# Altium schematic sheet sup&con.SchDoc
size 420 x 297 mm; PageSetup: Record=PageOptions|CenterHorizontal=True|CenterVertical=True|PrintScale=0.94|XCorrection=1.00|YCorrection=1.00|PrintKind=1|BorderSize=5000000|LeftOffset=0|BottomOffset=0|Orientation=1|PaperLength=1000|PaperWidth=1000|Scale=100|PaperSource=7|PrintQuality=-4|MediaType=1|DitherType=10|PaperKind=A4|PrintScaleMode=1; DecimalNumber: Децимальный номер; HeadOfSector: Нач. сектора; MainDevice: Перв.примен.; Name: Наименование
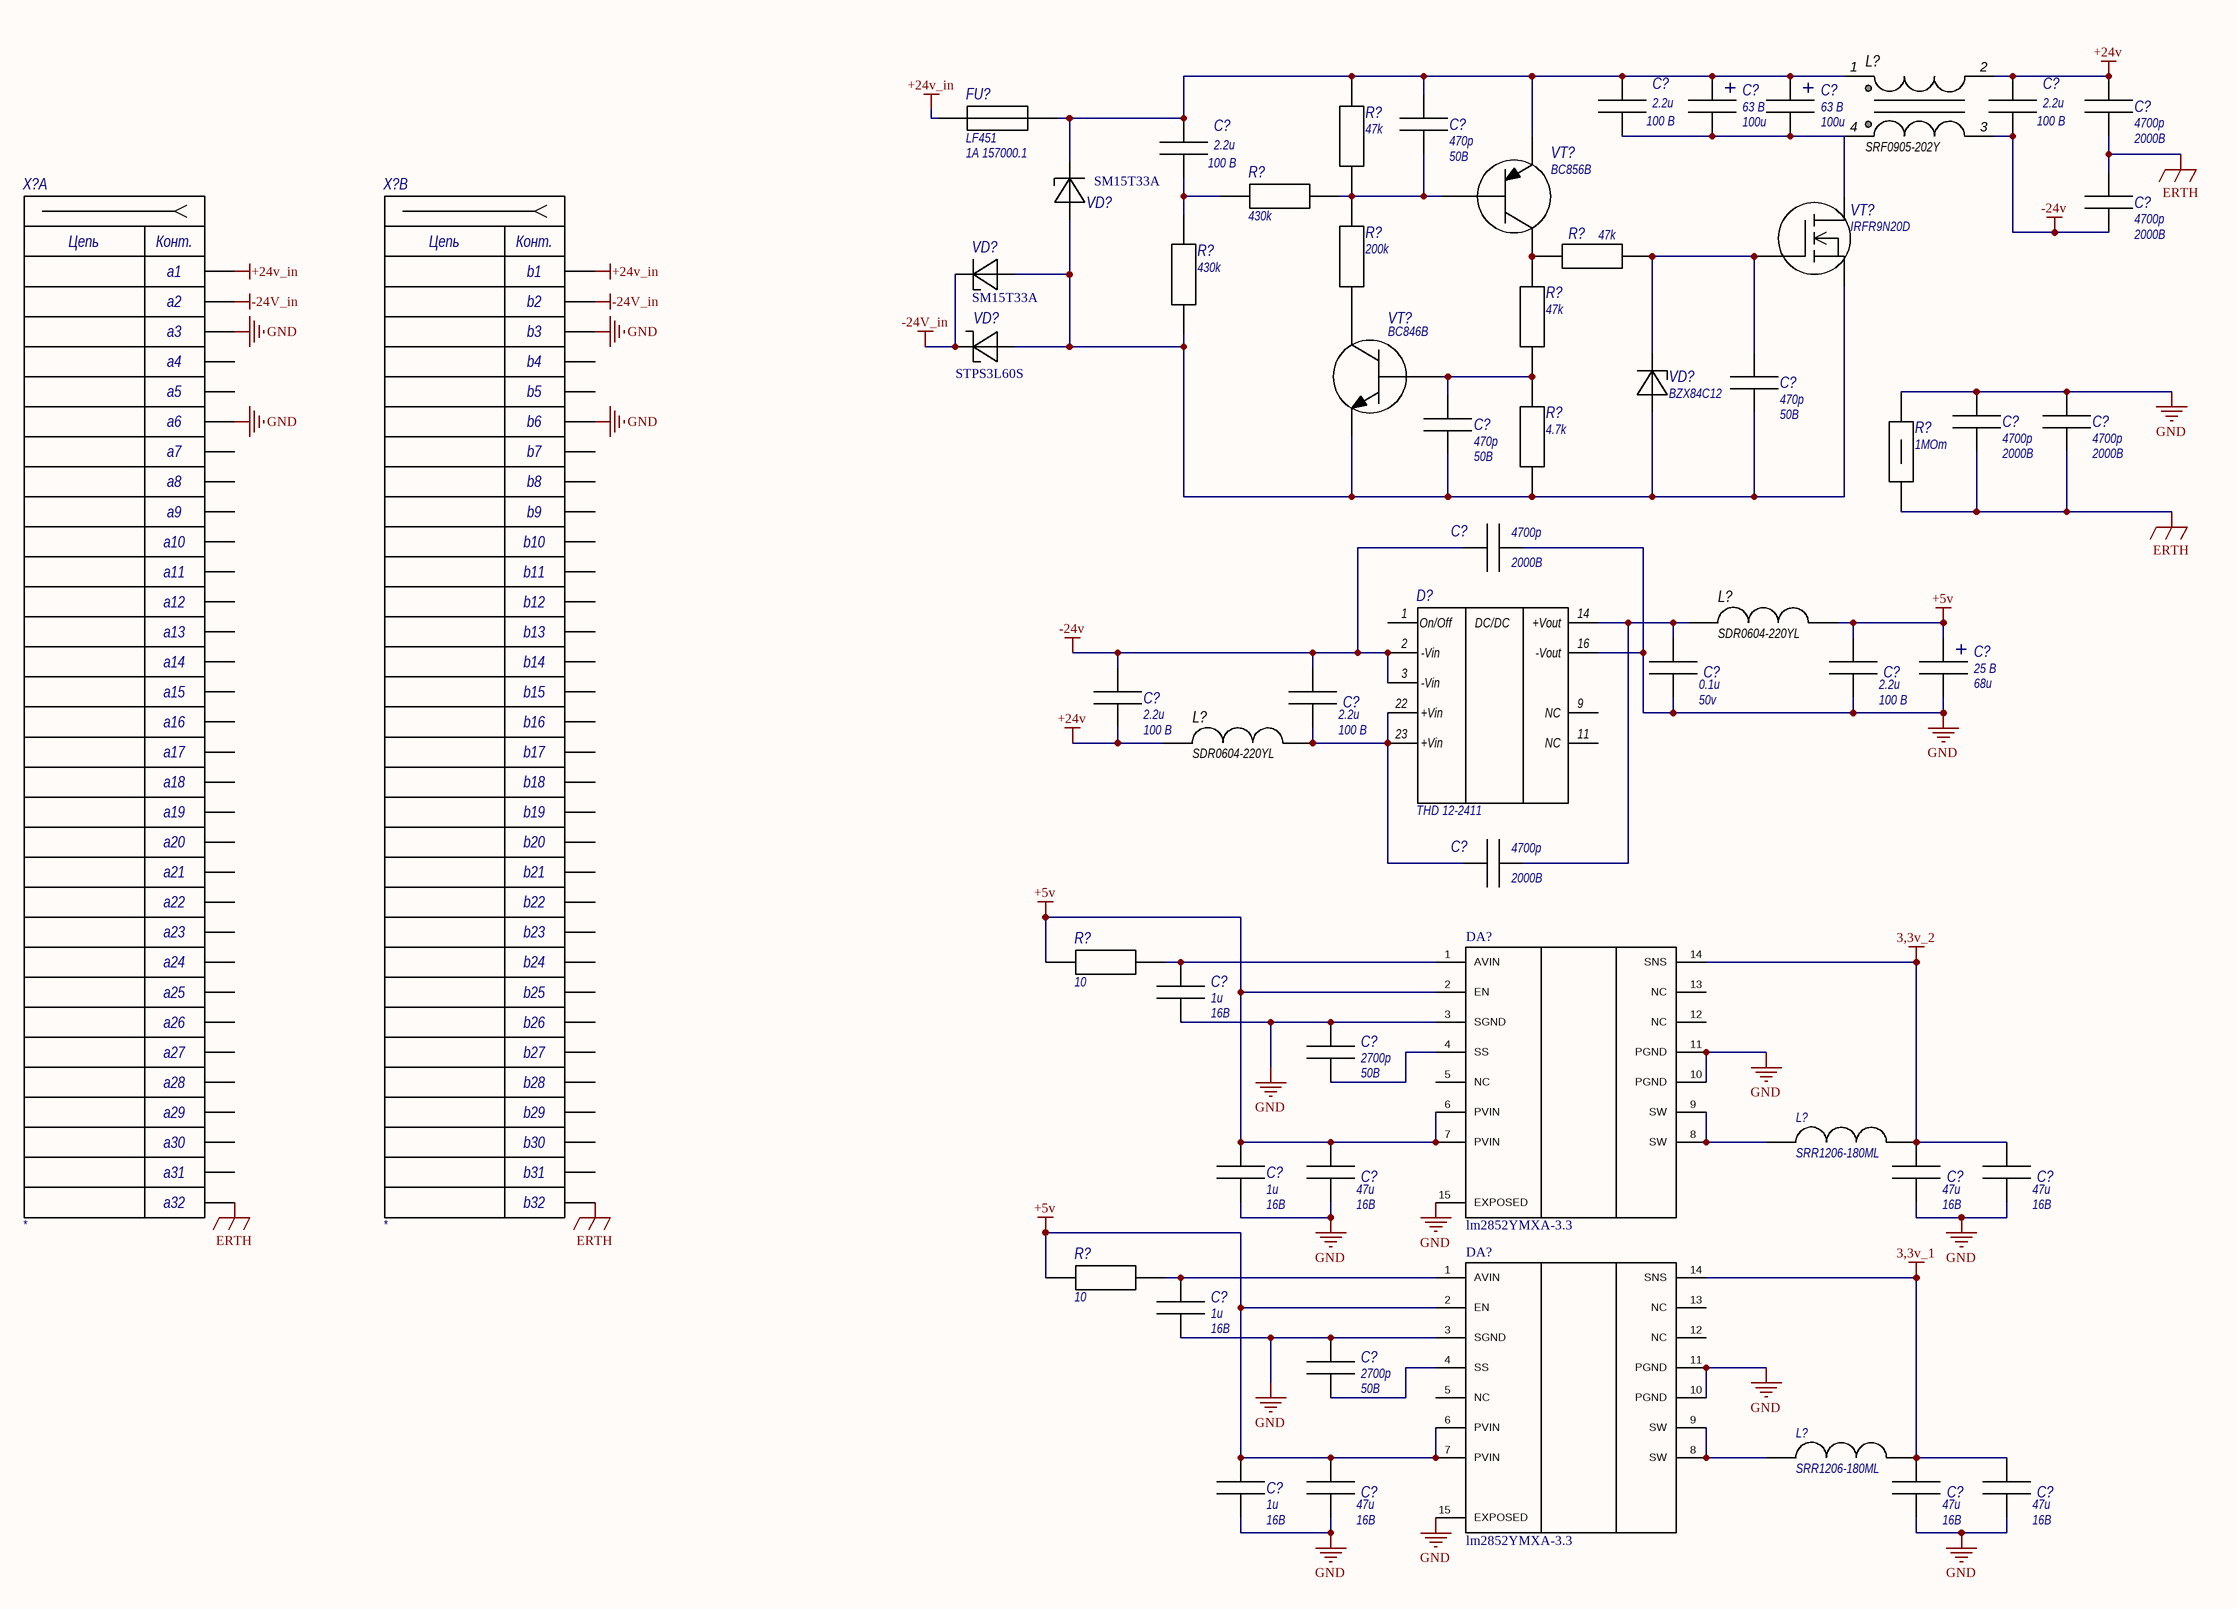
[diagram p0: sup&con.SchDoc]

## Parts
(Parts that share a designator on the sheet are numbered #1, #2 ... from top to bottom, then left to right.)
C?#1  value 2.2u  Voltage: 100 В  [C1210_]  (hidden comment: Capacitor ceramic)
C?#2  value 100u  Voltage: 63 В  [rad_cap_10х12]  (hidden comment: Capacitor electrolytic)
C?#3  value 100u  Voltage: 63 В  [rad_cap_10х12]  (hidden comment: Capacitor electrolytic)
C?#4  value 2.2u  Voltage: 100 В  [C1210_]  (hidden comment: Capacitor ceramic)
C?#5  value 4700p  Voltage: 2000В  [C1812_]  (hidden comment: Capacitor ceramic)
C?#6  Voltage: 50В  [C0603]  (hidden comment: 470p)
C?#7  value 2.2u  Voltage: 100 В  [C1210_]  (hidden comment: Capacitor ceramic)
C?#8  value 4700p  Voltage: 2000В  [C1812_]  (hidden comment: Capacitor ceramic)
C?#9  Voltage: 50В  [C0603]  (hidden comment: 470p)
C?#10  Voltage: 50В  [C0603]  (hidden comment: 470p)
C?#11  value 4700p  Voltage: 2000В  [C1812_]  (hidden comment: Capacitor ceramic)
C?#12  value 4700p  Voltage: 2000В  [C1812_]  (hidden comment: Capacitor ceramic)
C?#13  value 4700p  Voltage: 2000В  [C1812_]  (hidden comment: Capacitor ceramic)
C?#14  value 0.1u  Voltage: 50v  [C0603]  (hidden comment: Capacitor ceramic)
C?#15  value 2.2u  Voltage: 100 В  [C1210_]  (hidden comment: Capacitor ceramic)
C?#16  value 68u  Voltage: 25 В  [D_]  (hidden comment: T491)
C?#17  value 2.2u  Voltage: 100 В  [C1210_]  (hidden comment: Capacitor ceramic)
C?#18  value 2.2u  Voltage: 100 В  [C1210_]  (hidden comment: Capacitor ceramic)
C?#19  value 4700p  Voltage: 2000В  [C1812_]  (hidden comment: Capacitor ceramic)
C?#20  value 1u  Voltage: 16В  [C0603]  (hidden comment: 470p)
C?#21  value 2700p  Voltage: 50В  [C0603]  (hidden comment: 470p)
C?#22  value 1u  Voltage: 16В  [C0603]  (hidden comment: 470p)
C?#23  value 47u  Voltage: 16В  [C1210_]  (hidden comment: Capacitor ceramic)
C?#24  value 47u  Voltage: 16В  [C1210_]  (hidden comment: Capacitor ceramic)
C?#25  value 47u  Voltage: 16В  [C1210_]  (hidden comment: Capacitor ceramic)
C?#26  value 1u  Voltage: 16В  [C0603]  (hidden comment: 470p)
C?#27  value 2700p  Voltage: 50В  [C0603]  (hidden comment: 470p)
C?#28  value 1u  Voltage: 16В  [C0603]  (hidden comment: 470p)
C?#29  value 47u  Voltage: 16В  [C1210_]  (hidden comment: Capacitor ceramic)
C?#30  value 47u  Voltage: 16В  [C1210_]  (hidden comment: Capacitor ceramic)
C?#31  value 47u  Voltage: 16В  [C1210_]  (hidden comment: Capacitor ceramic)
D?  Type: THD 12-2411  [THD_12-2411]  (hidden comment: TMR 3-2422)
DA?#1  lm2852YMXA-3.3  [HTSSOP14N]
DA?#2  lm2852YMXA-3.3  [HTSSOP14N]
FU?  value 1A 157000.1  [LF451-1]  (hidden comment: LF451)
L?#1  value SRF0905-202Y  [SRF0905]  (hidden comment: SRF0905)
L?#2  value SDR0604-220YL  [SDR0604_]  (hidden comment: SDR0604_1)
L?#3  value SDR0604-220YL  [SDR0604_]  (hidden comment: SDR0604_1)
L?#4  Type: SRR1206-180ML  [SRR1206]  (hidden comment: SRR1206)
L?#5  Type: SRR1206-180ML  [SRR1206]  (hidden comment: SRR1206)
R?#1  value 47k  [R0603]  (hidden comment: 47k ±5%)
R?#2  value 430k  [R0603]  (hidden comment: 430k ±5%)
R?#3  value 200k  [R0603]  (hidden comment: 200k ±5%)
R?#4  value 47k  [R0603]  (hidden comment: 47k ±5%)
R?#5  value 430k  [R0603]  (hidden comment: 430k ±5%)
R?#6  value 47k  [R0603]  (hidden comment: 47k ±5%)
R?#7  value 4.7k  [R0603]  (hidden comment: 4.7k ±5%)
R?#8  value 1MOm  [R1210]  (hidden comment: 1MOm ±5%)
R?#9  value 10  [R0603]  (hidden comment: 10 ±5%)
R?#10  value 10  [R0603]  (hidden comment: 10 ±5%)
VD?#1  SM15T33A  [SMC]
VD?#2  SM15T33A  [SMC]
VD?#3  STPS3L60S  [SMC]
VD?#4  Type: BZX84C12  [SOT-23]  (hidden comment: BZX84)
VT?#1  Type: BC856B  [SOT-23]  (hidden comment: BC807)
VT?#2  Type: IRFR9N20D  [D-PAK]  (hidden comment: IRFR4620)
VT?#3  Type: BC846B  [SOT-23]  (hidden comment: BC817)
X?#1  DIN41612_96FR (HARTING)  [DIN41612 3x32 64FR]  (value not drawn)  (part A of 2)
X?#2  DIN41612_96FR (HARTING)  [DIN41612 3x32 64FR]  (value not drawn)  (part B of 2)

## Nets
3,3v_1: C?#30.2 C?#31.2 DA?#2.14(SNS) L?#5.2
3,3v_2: C?#24.2 C?#25.2 DA?#1.14(SNS) L?#4.2
+5v: C?#15.2 C?#16.1 C?#22.2 C?#23.2 C?#28.2 C?#29.2 DA?#1.2(EN) DA?#1.6(PVIN) DA?#1.7(PVIN) DA?#2.2(EN) DA?#2.6(PVIN) DA?#2.7(PVIN) L?#2.2 R?#9.1 R?#10.1
+24v: C?#4.2 C?#5.2 C?#17.1 L?#1.2 L?#3.1
+24v_in: FU?.1 X?#1.a1 X?#2.b1
-24v: C?#4.1 C?#8.1 C?#13.1 C?#17.2 C?#18.2 D?.2(-Vin) D?.3(-Vin) L?#1.3
-24V_in: VD?#2.3(K) VD?#3.3(K) X?#1.a2 X?#2.b2
ERTH: C?#5.1 C?#8.2 C?#11.1 C?#12.1 R?#8.1 X?#1.a32 X?#2.b32
GND: C?#11.2 C?#12.2 C?#13.2 C?#14.1 C?#15.1 C?#16.2 C?#20.1 C?#21.2 C?#22.1 C?#23.1 C?#24.1 C?#25.1 C?#26.1 C?#27.2 C?#28.1 C?#29.1 C?#30.1 C?#31.1 D?.16(-Vout) DA?#1.3(SGND) DA?#1.10(PGND) DA?#1.11(PGND) DA?#1.15(EXPOSED) DA?#2.3(SGND) DA?#2.10(PGND) DA?#2.11(PGND) DA?#2.15(EXPOSED) R?#8.2 X?#1.a3 X?#1.a6 X?#2.b3 X?#2.b6
NetC?#1_1: C?#1.1 C?#2.2(K) C?#3.2(K) L?#1.4 VT?#2.3
NetC?#1_2: C?#1.2 C?#2.1(A) C?#3.1(A) C?#6.2 C?#7.2 FU?.2 L?#1.1 R?#1.1 VD?#1.3(K) VT?#1.2
NetC?#6_1: C?#6.1 R?#1.2 R?#2.1 R?#3.1 VT?#1.1
NetC?#7_1: C?#7.1 R?#2.2 R?#5.2
NetC?#9_1: C?#9.1 C?#10.1 R?#5.1 R?#7.1 VD?#1.VD(A) VD?#2.VD(A) VD?#3.1(A) VD?#4.1(A) VT?#2.2 VT?#3.2
NetC?#9_2: C?#9.2 R?#4.2 VD?#4.3(K) VT?#2.1
NetC?#10_2: C?#10.2 R?#6.1 R?#7.2 VT?#3.1
NetC?#14_2: C?#14.2 C?#19.2 D?.14(+Vout) L?#2.1
NetC?#18_1: C?#18.1 C?#19.1 D?.22(+Vin) D?.23(+Vin) L?#3.2
NetC?#20_2: C?#20.2 DA?#1.1(AVIN) R?#9.2
NetC?#21_1: C?#21.1 DA?#1.4(SS)
NetC?#26_2: C?#26.2 DA?#2.1(AVIN) R?#10.2
NetC?#27_1: C?#27.1 DA?#2.4(SS)
NetDA?#1_8: DA?#1.8(SW) DA?#1.9(SW) L?#4.1
NetDA?#2_8: DA?#2.8(SW) DA?#2.9(SW) L?#5.1
NetR?#3_2: R?#3.2 VT?#3.3
NetR?#4_1: R?#4.1 R?#6.2 VT?#1.3

Not connected (* = marked no-connect by the designer): D? 1(On/Off) 9(NC) 11(NC); DA?#1 5(NC) 12(NC) 13(NC); DA?#2 5(NC) 12(NC) 13(NC); X?#1 a4 a5 a7 a8 a9 a10 a11 a12 a13 a14 a15 a16 a17 a18 a19 a20 a21 a22 a23 a24 a25 a26 a27 a28 a29 a30 a31; X?#2 b4 b5 b7 b8 b9 b10 b11 b12 b13 b14 b15 b16 b17 b18 b19 b20 b21 b22 b23 b24 b25 b26 b27 b28 b29 b30 b31

## Notes on the sheet
- Подп. и дата
- Инв.№ дубл.
- Взам.инв.№
- Подп.и дата
- Инв.№ подл.
- Изм.
- Лист
- № докум.
- Подп.
- Дата
- Формат  A3
- (in symbol Capacitor electrolytic) +
- (in symbol Capacitor tantal) +
- (in symbol DIN41612_96FR (HARTING), part A) Цепь; Конт.
- (in symbol DIN41612_96FR (HARTING), part B) Цепь; Конт.
- (in symbol TMR 3-2422) DC/DC

## Library data of the parts
C?#1 C?#4 C?#7 C?#15 C?#17 C?#18 = Capacitor ceramic: Capacitance: 2.2u x 100 В; Dielectric: *; Tolerance: *
C?#2 C?#3 = Capacitor electrolytic: radial 10x12; Tolerance: ±20%; Polarization: Polar; Capacitance: 100u x 63 В; Famile: Capacitor; Category: Capacitors; Operating Temperature: -40°C ~ 105°C; Package / Case: Radial, Can - SMD; ComponentLink1Description: Параметры; ComponentLink1URL: 5\res\Справочники\Конденсаторы\KEM_A4003_EXV.pdf; Dielectric: *
C?#5 C?#8 C?#11-C?#13 C?#19 = Capacitor ceramic: Capacitance: 4700p x 2000В; Dielectric: *; Tolerance: *
C?#6 C?#9 C?#10 = Capacitor ceramic: Capacitance: 470p x 50В; Dielectric: *; Tolerance: *; Value: 470p
C?#14 = Capacitor ceramic: Capacitance: 0.1u x 50v; Dielectric: *; Tolerance: *
C?#16 = Capacitor tantal: Solid Tantalum Chip Capacitor, Standard T491 Series - Industrial Grade; Capacitance: 68u x 25 В; ComponentLink1Description: Manufacturer Link; ComponentLink2Description: Datasheet; ComponentLink1URL: http://www.kemet.com/; ComponentLink2URL: http://www.kemet.com/kemet/web/homepage/kechome.nsf/vapubfilesname/F3102TA.pdf/$file/F3102TA.pdf; Dielectric: *; Tolerance: *
C?#20 C?#22 C?#26 C?#28 = Capacitor ceramic: Capacitance: 1u x 16В; Dielectric: *; Tolerance: *
C?#21 C?#27 = Capacitor ceramic: Capacitance: 2700p x 50В; Dielectric: *; Tolerance: *
C?#23-C?#25 C?#29-C?#31 = Capacitor ceramic: Capacitance: 47u x 16В; Dielectric: *; Tolerance: *
DA?#1 DA?#2 = LM2852
L?#2 L?#3 = SDR0604_1: SDR0604
R?#1-R?#7 R?#9 R?#10 = R0603: Precision: ±5%
R?#8 = R1210: Precision: ±5%
VD?#1 VD?#2 = Stab: stab 33V
VD?#3 = Shotky: shotky 60v 3A
FU? = LF451: Type: LF451
L?#4 L?#5 = SRR1206: Value: *
X?#1 X?#2 = DIN41612_96FR (HARTING): Type: *